# Altium schematic sheet Schémas V2.SchDoc
size A2
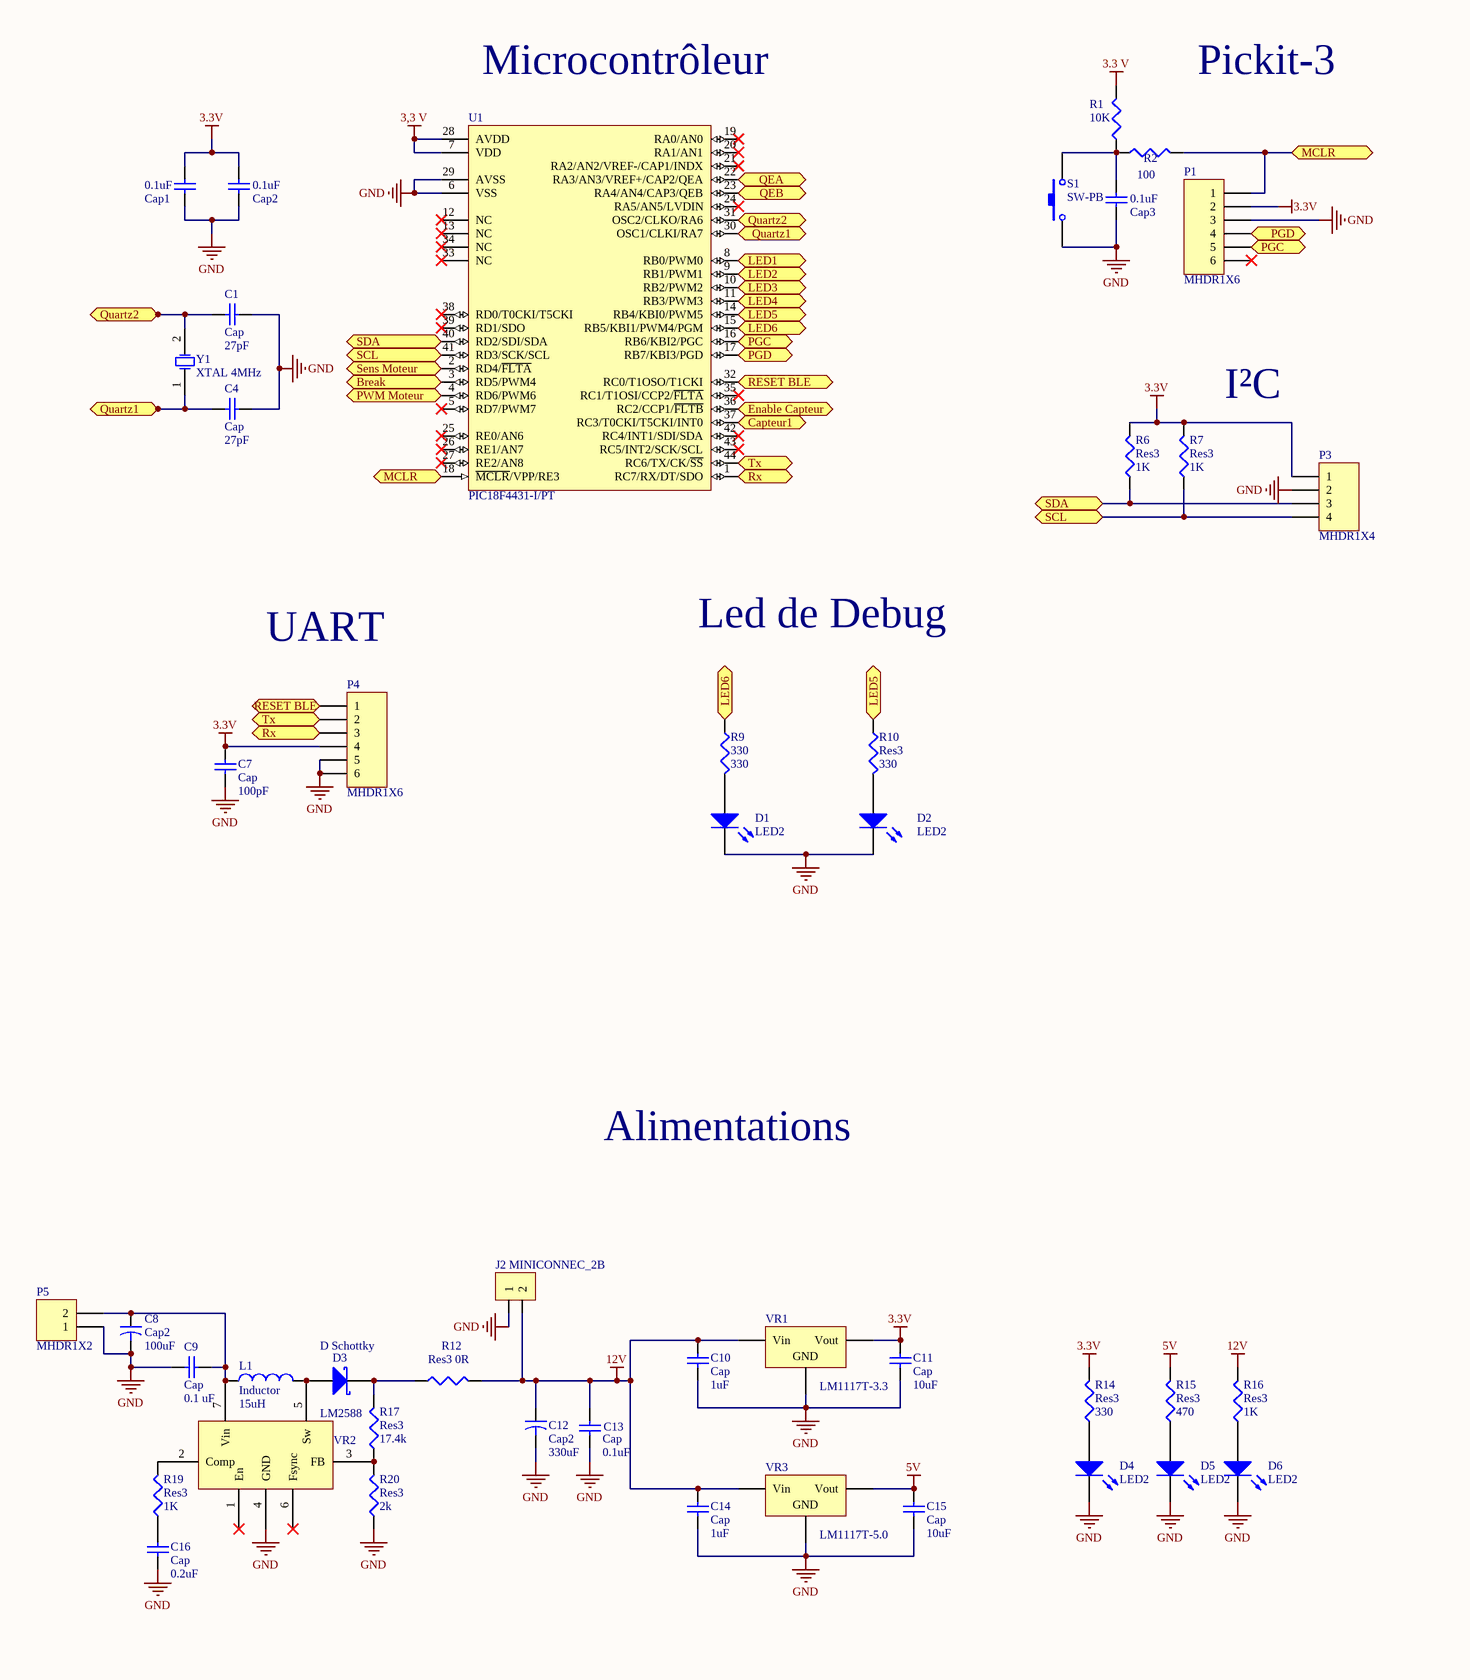
[diagram p0: Schémas V2.SchDoc, left]
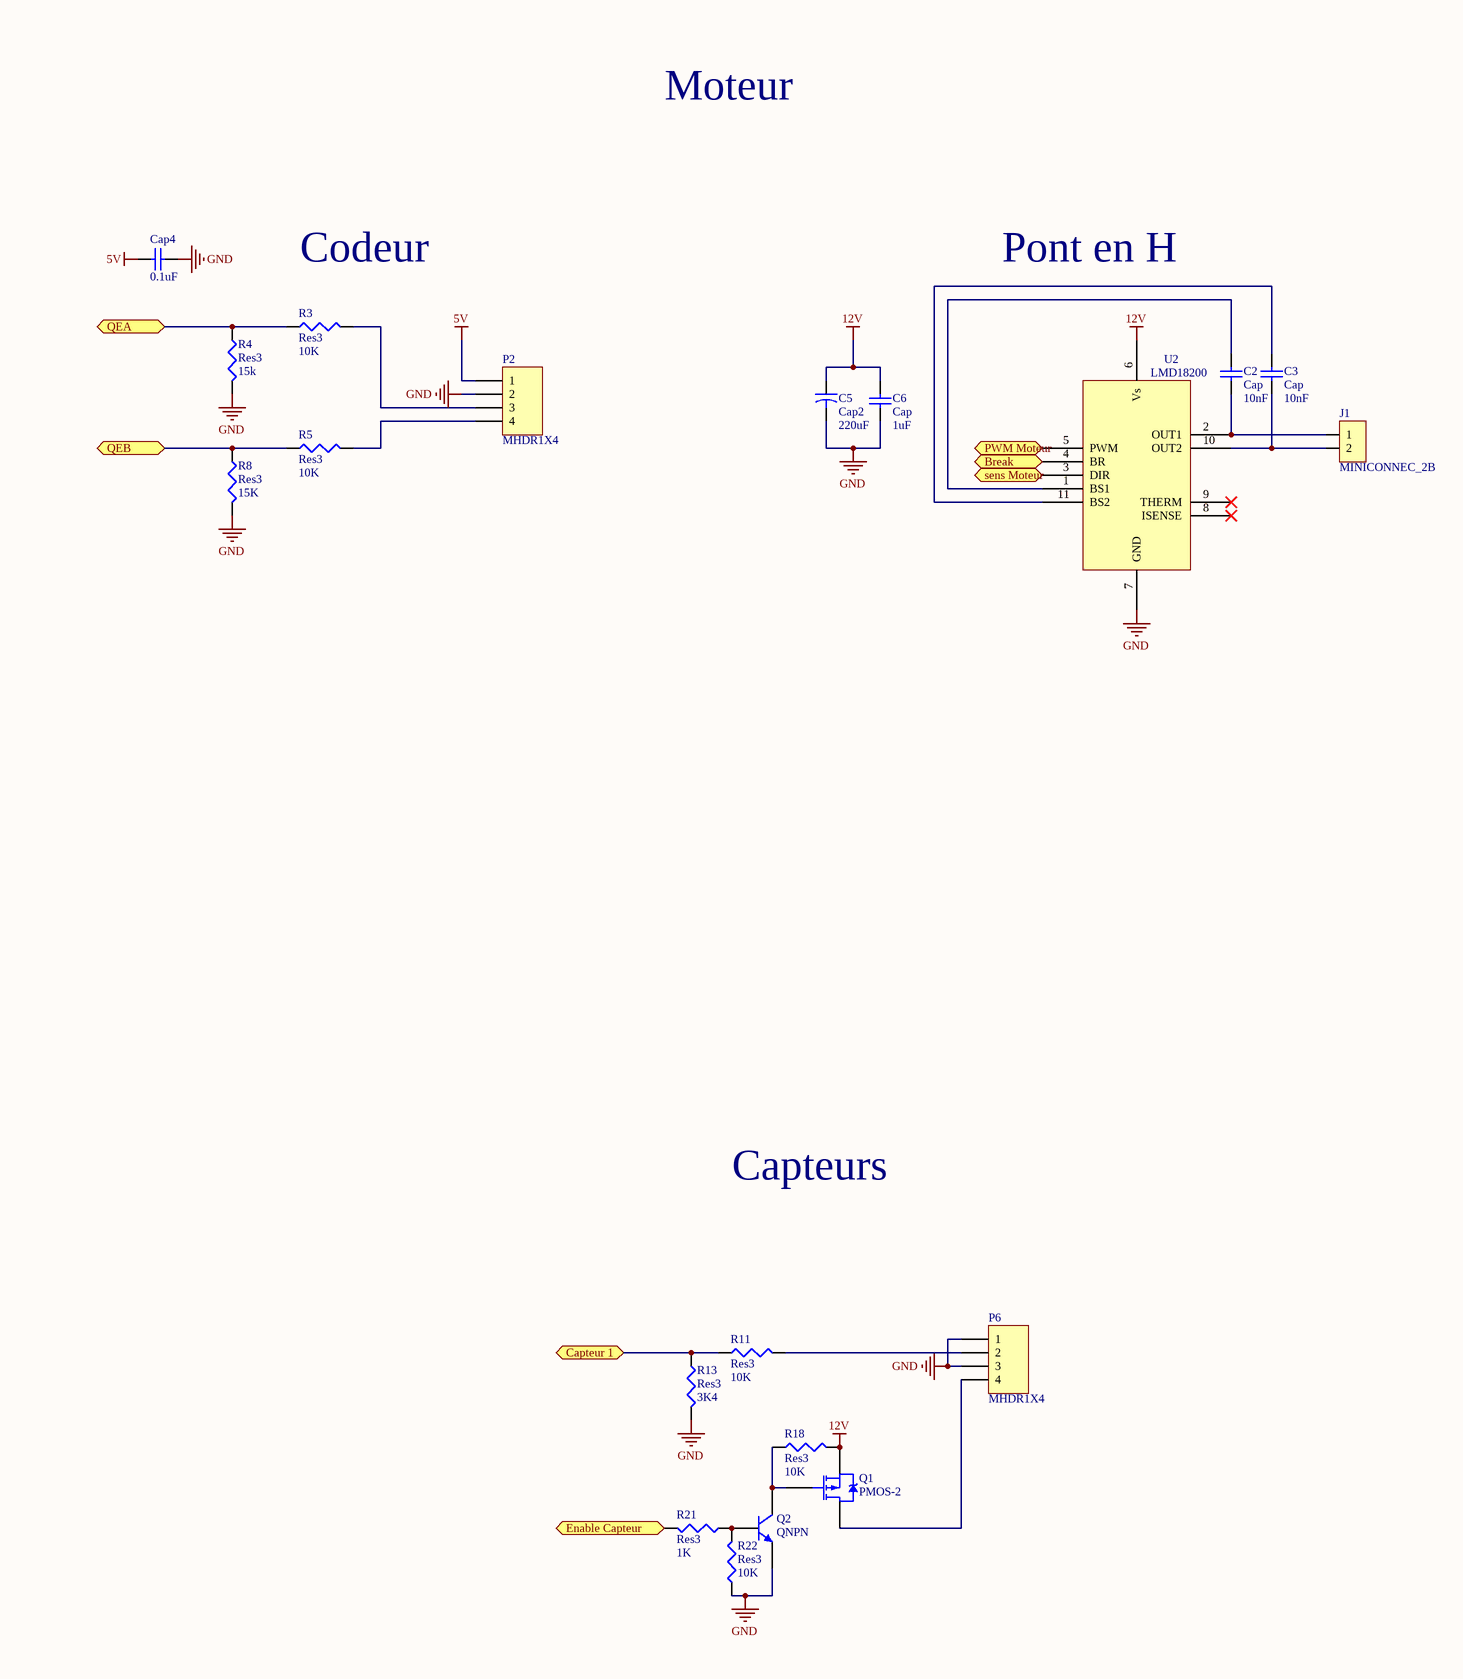
[diagram p1: Schémas V2.SchDoc, right]

## Parts
C1  Cap  value 27pF  [RAD-0.3]
C2  Cap  value 10nF  [RAD-0.3]
C3  Cap  value 10nF  [RAD-0.3]
C4  Cap  value 27pF  [RAD-0.3]
C5  Cap2  value 220uF  [CAPR5-4X5]
C6  Cap  value 1uF  [RAD-0.3]
C7  Cap  value 100pF  [RAD-0.3]
C8  Cap2  value 100uF  [CAPR5-4X5]
C9  Cap  value 0.1 uF  [RAD-0.3]
C10  Cap  value 1uF  [RAD-0.3]
C11  Cap  value 10uF  [RAD-0.3]
C12  Cap2  value 330uF  [CAPR5-4X5]
C13  Cap  value 0.1uF  [RAD-0.3]
C14  Cap  value 1uF  [RAD-0.3]
C15  Cap  value 10uF  [RAD-0.3]
C16  Cap  value 0.2uF  [RAD-0.3]
Cap1  0.1uF  [RAD-0.3]
Cap2  0.1uF  [RAD-0.3]
Cap3  0.1uF  [0805]
Cap4  0.1uF  [RAD-0.3]
D1  LED2  [DSO-F2/D6.1]
D2  LED2  [DSO-F2/D6.1]
D3  D Schottky  [DSO-C2/X2.3]
D4  LED2  [DSO-F2/D6.1]
D5  LED2  [DSO-F2/D6.1]
D6  LED2  [DSO-F2/D6.1]
J1  MINICONNEC_2B  [MINICONNEC_C]
J2  MINICONNEC_2B  [MINICONNEC_C]
L1  Inductor  value 15uH  [INDC1005AL]
P1  MHDR1X6  [MHDR1X6]
P2  MHDR1X4  [MHDR1X4]
P3  MHDR1X4  [MHDR1X4]
P4  MHDR1X6  [MHDR1X6]
P5  MHDR1X2  [MHDR1X2]
P6  MHDR1X4  [MHDR1X4]
Q1  PMOS-2  [SFM-T3/A4.7V]
Q2  QNPN  [SOT95P240-3N]
R1  value 10K  [RESC1608L]  (hidden comment: Res3)
R2  value 100  [RESC1608L]  (hidden comment: Res3)
R3  Res3  value 10K  [RESC1608L]
R4  Res3  value 15k  [RESC1608L]
R5  Res3  value 10K  [RESC1608L]
R6  Res3  value 1K  [RESC1608L]
R7  Res3  value 1K  [RESC1608L]
R8  Res3  value 15K  [RESC1608L]
R9  330  [RESC1608L]
R10  Res3  value 330  [RESC1608L]
R11  Res3  value 10K  [RESC1608L]
R12  Res3  value 0R  [RESC1608L]
R13  Res3  value 3K4  [RESC1608L]
R14  Res3  value 330  [RESC1608L]
R15  Res3  value 470  [RESC1608L]
R16  Res3  value 1K  [RESC1608L]
R17  Res3  value 17.4k  [RESC1608L]
R18  Res3  value 10K  [RESC1608L]
R19  Res3  value 1K  [RESC1608L]
R20  Res3  value 2k  [RESC1608L]
R21  Res3  value 1K  [RESC1608L]
R22  Res3  value 10K  [RESC1608L]
S1  SW-PB  [SPST-2]
U1  PIC18F4431-I/PT  [TQFP-PT44_L]
U2  LMD18200  [TA11B]  (value not drawn)
VR1  LM1117T-3.3  [TO254P1510-3_4N]
VR2  LM2588
VR3  LM1117T-5.0  [TO254P1510-3_4N]
Y1  XTAL 4MHz  [BCY-W2/D3.1]

## Ports
Break, Break (bidir), Capteur1 (bidir), Capteur 1, Enable Capteur, Enable Capteur (bidir), LED1 (bidir), LED2 (bidir), LED3 (bidir), LED4 (bidir), LED5 (bidir), LED6 (bidir), MCLR (bidir), PGC (bidir), PGD (bidir), PWM Moteur (bidir), QEA (bidir), QEB (bidir), Quartz1, Quartz1 (bidir), Quartz2, Quartz2 (bidir), RESET BLE (bidir), Rx (bidir), SCL (bidir), SDA (bidir), Sens Moteur (bidir), sens Moteur (bidir), Tx (bidir)

## Nets
3,3 V: U1.7(VDD) U1.28(AVDD)
3.3 V: R1.2
3.3V: C7.2 C11.2 Cap1.2 Cap2.2 P1.2 P3.1 P4.4 R6.2 R7.2 R14.2 VR1.3(Vout)
5V: C15.2 Cap4.2 P2.1 R15.2 VR3.3(Vout)
12V: C5.1 C6.2 C10.2 C12.1 C13.2 C14.2 J2.2 Q1.3(S) R12.2 R16.2 R18.2 U2.6(Vs) VR1.1(Vin) VR3.1(Vin)
GND: C1.1 C4.1 C5.2 C6.1 C7.1 C8.2 C9.1 C10.1 C11.1 C12.2 C13.1 C14.1 C15.1 C16.1 Cap1.1 Cap2.1 Cap3.1 Cap4.1 D1.2(K) D2.2(K) D4.2(K) D5.2(K) D6.2(K) J2.1 P1.3 P2.2 P3.2 P4.5 P4.6 P5.1 P6.1 P6.3 Q2.3(E) R4.2 R8.2 R13.2 R20.1 R22.1 S1.1 U1.6(VSS) U1.29(AVSS) U2.7(GND) VR1.2(GND) VR2.4(GND) VR3.2(GND)
Break: U1.3(RD5/PWM4) U2.4(BR) ; port Break
Capteur1: U1.37(RC3/T0CKI/T5CKI/INT0) ; port Capteur1
Capteur 1: R11.1 R13.1 ; port Capteur 1
Enable Capteur: R21.2 U1.36(RC2/CCP1/~{FLTB}) ; port Enable Capteur
LED1: U1.8(RB0/PWM0) ; port LED1
LED2: U1.9(RB1/PWM1) ; port LED2
LED3: U1.10(RB2/PWM2) ; port LED3
LED4: U1.11(RB3/PWM3) ; port LED4
LED5: R10.1 U1.14(RB4/KBI0/PWM5) ; port LED5
LED6: R9.1 U1.15(RB5/KBI1/PWM4/PGM) ; port LED6
MCLR: P1.1 R2.2 U1.18(~{MCLR}/VPP/RE3) ; port MCLR
PGC: P1.5 U1.16(RB6/KBI2/PGC) ; port PGC
PGD: P1.4 U1.17(RB7/KBI3/PGD) ; port PGD
PWM Moteur: U1.4(RD6/PWM6) U2.5(PWM) ; port PWM Moteur
QEA: R3.1 R4.1 U1.22(RA3/AN3/VREF+/CAP2/QEA) ; port QEA
QEB: R5.1 R8.1 U1.23(RA4/AN4/CAP3/QEB) ; port QEB
Quartz1: C4.2 U1.30(OSC1/CLKI/RA7) Y1.1(OSC1) ; port Quartz1
Quartz2: C1.2 U1.31(OSC2/CLKO/RA6) Y1.2(OSC2) ; port Quartz2
RESET BLE: P4.1 U1.32(RC0/T1OSO/T1CKI) ; port RESET BLE
Rx: P4.3 U1.1(RC7/RX/DT/SDO) ; port Rx
SCL: P3.4 R7.1 U1.41(RD3/SCK/SCL) ; port SCL
SDA: P3.3 R6.1 U1.40(RD2/SDI/SDA) ; port SDA
Sens Moteur: U1.2(RD4/~{FLTA}) U2.3(DIR) ; port Sens Moteur, port sens Moteur
Tx: P4.2 U1.44(RC6/TX/CK/~{SS}) ; port Tx
NetC2_1: C2.1 J1.1 U2.2(OUT1)
NetC2_2: C2.2 U2.1(BS1)
NetC3_1: C3.1 U2.11(BS2)
NetC3_2: C3.2 J1.2 U2.10(OUT2)
NetC8_1: C8.1 C9.2 L1.1 P5.2 VR2.7(Vin)
NetC16_2: C16.2 R19.1
NetCap3_2: Cap3.2 R1.1 R2.1 S1.2
NetD1_1: D1.1(A) R9.2
NetD2_1: D2.1(A) R10.2
NetD3_1: D3.1(A) L1.2 VR2.5(Sw)
NetD3_2: D3.2(K) R12.1 R17.2
NetD4_1: D4.1(A) R14.1
NetD5_1: D5.1(A) R15.1
NetD6_1: D6.1(A) R16.1
NetP2_3: P2.3 R3.2
NetP2_4: P2.4 R5.2
NetP6_2: P6.2 R11.2
NetP6_4: P6.4 Q1.2(D)
NetQ1_1: Q1.1(G) Q2.1(C) R18.1
NetQ2_2: Q2.2(B) R21.1 R22.2
NetR17_1: R17.1 R20.2 VR2.3(FB)
NetR19_2: R19.2 VR2.2(Comp)

Not connected (* = marked no-connect by the designer): P1 6*; U1 5(RD7/PWM7)* 12(NC)* 13(NC)* 19(RA0/AN0)* 20(RA1/AN1)* 21(RA2/AN2/VREF-/CAP1/INDX)* 24(RA5/AN5/LVDIN)* 25(RE0/AN6)* 26(RE1/AN7)* 27(RE2/AN8)* 33(NC)* 34(NC)* 35(RC1/T1OSI/CCP2/~{FLTA})* 38(RD0/T0CKI/T5CKI)* 39(RD1/SDO)* 42(RC4/INT1/SDI/SDA)* 43(RC5/INT2/SCK/SCL)*; U2 8(ISENSE)* 9(THERM)*; VR2 1(En)* 6(Fsync)*

## Notes on the sheet
- Microcontrôleur
- Pickit-3
- Moteur
- Codeur
- Pont en H
- I²C
- UART
- Led de Debug
- Alimentations
- Capteurs

## Library data of the parts
C1-C4 C6 C7 C9-C11 C13-C16 Cap1-Cap4 = Cap: Capacitor; Published: 8-Jun-2000; LatestRevisionDate: 17-Jul-2002; LatestRevisionNote: Re-released for DXP Platform.; PackageReference: RAD-0.3; Publisher: Altium Limited
C5 C8 C12 = Cap2: Capacitor; Published: 23-Sep-2002; PackageReference: CAPR5-4X5; Publisher: Altium Limited
D1 D2 D4-D6 = LED2: Typical RED, GREEN, YELLOW, AMBER GaAs LED; Published: 8-Jun-2000; LatestRevisionDate: 17-Jul-2002; LatestRevisionNote: Re-released for DXP Platform.; PackageVersion: Feb-2002; PackageReference: 3.2X1.6X1.1; Publisher: Altium Limited
D3 = D Schottky: Schottky Diode; Published: 8-Jun-2000; LatestRevisionDate: 17-Jul-2002; LatestRevisionNote: Re-released for DXP Platform.; PackageReference: SMB; Publisher: Altium Limited; Code_JEDEC: DO-214-AA
J1 J2 = MINICONNEC_2B: Connecteur
L1 = Inductor: Code_IEC: 1005; Published: 8-Jun-2000; LatestRevisionDate: 29-May-2009; LatestRevisionNote: IPC-7351 Footprint Added.; PackageReference: 0402-A; Publisher: Altium Limited; PackageDescription: Chip Inductor; Code_JEITA: 0402
P1 P4 = MHDR1X6: Header, 6-Pin; LatestRevisionDate: 17-Jul-2002; LatestRevisionNote: Re-released for DXP Platform.; Publisher: Altium Limited
P2 P3 P6 = MHDR1X4: Header, 4-Pin; LatestRevisionDate: 17-Jul-2002; LatestRevisionNote: Re-released for DXP Platform.; Publisher: Altium Limited
P5 = MHDR1X2: Header, 2-Pin; LatestRevisionDate: 17-Jul-2002; LatestRevisionNote: Re-released for DXP Platform.; Publisher: Altium Limited
Q1 = PMOS-2: P-Channel Power MOSFET; Note: Pin 4 not drawn and electrically connected to Pin 2.; Published: 8-Jun-2000; LatestRevisionDate: 17-Jul-2002; LatestRevisionNote: Re-released for DXP Platform.; DatasheetVersion: PD-9.390D; PackageReference: TO-220AB; Publisher: Altium Limited; Code_JEDEC: TO-220-AB; ComponentLink1Description: Manufacturer Link; ComponentLink1URL: http://www.irf.com/
Q2 = QNPN: NPN Bipolar Transistor; Published: 8-Jun-2000; LatestRevisionDate: 29-May-2009; LatestRevisionNote: IPC-7351 Footprint Added.; PackageVersion: Aug-1999; PackageReference: SOT-23B; Publisher: Altium Limited; PackageDescription: 3-Pin SOT-23 Package 0.95 mm Pitch, 2.4 mm Lead Span
R1-R22 = Res3: Resistor; Published: 8-Jun-2000; LatestRevisionDate: 29-May-2009; LatestRevisionNote: IPC-7351 Footprint Added.; PackageReference: J1-0603; Publisher: Altium Limited; PackageDescription: Chip Resistor
  R9: Value: 330
S1 = SW-PB: Switch; Published: 24-Mar-1999; LatestRevisionDate: 17-Jul-2002; LatestRevisionNote: Re-released for DXP Platform.; PackageReference: SPST-2; Publisher: Altium Limited
U1 = PIC18F4431-I/PT: Enhanced Flash Microcontroller with nanoWatt Technology, High Performance PWM and A/D, 16K Flash, 44-Pin TQFP, Industrial Temperature; FirstPublished: 11-Oct-2004; LatestRevisionDate: 29-Jan-2009; LatestRevisionNote: Sch. layout revised. 3D Model Removed.; DatasheetVersion: revC, Jul-2007; PackageVersion: revBB, Aug-2009; PackageReference: TQFP-PT44; Publisher: Altium Limited; PackageDescription: 44-Lead Plastic Thin Quad Flatpack (PT) - 10x10x1mm Body, 2.00mm [TQFP]; Supplier 1: Digi-Key; Supplier Part Number 1: PIC18F4431-I/PT-ND; Supplier 2: Farnell; Supplier Part Number 2: 1137346; Supplier 3: Farnell; Supplier Part Number 3: 1137420; Supplier 4: Farnell; Supplier Part Number 4: 1528308; Supplier 5: Newark; Supplier Part Number 5: 61K3473; Code_JEDEC: MS-026; ComponentLink1Description: Datasheet; ComponentLink1URL: http://ww1.microchip.com/downloads/en/DeviceDoc/39616C.pdf; ComponentLink2Description: Packaging Specification; ComponentLink2URL: http://www.microchip.com/stellent/groups/techpub_sg/documents/packagingspec/en012702.pdf; ComponentLink3Description: Microchip.com Home; ComponentLink3URL: http://www.microchip.com/
U2 = LMD18200: Pont-H
VR1 VR3 = Volt Reg: Voltage Regulator; Published: 24-Mar-1999; LatestRevisionDate: 29-May-2009; LatestRevisionNote: IPC-7351 Footprint Added.; PackageReference: D2PAK; Publisher: Altium Limited; PackageDescription: 3-Pin Transistor Outline Package 2.54 mm Pitch, 15.1 mm Lead Span
Y1 = XTAL: Crystal Oscillator; Published: 8-Jun-2000; LatestRevisionDate: 17-Jul-2002; LatestRevisionNote: Re-released for DXP Platform.; PackageReference: R38; Publisher: Altium Limited